# Altium schematic sheet Sheet1.SchDoc
size A4
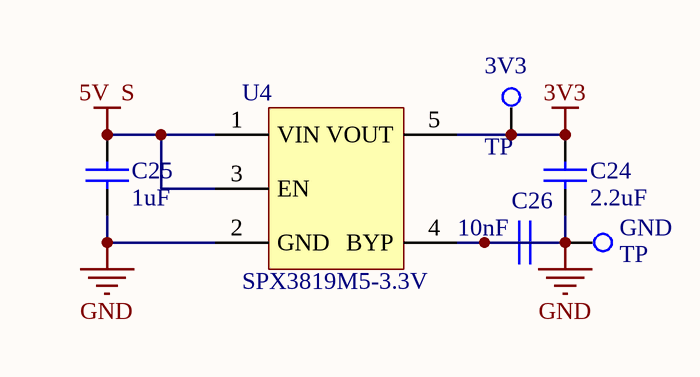
[diagram p0: Sheet1.SchDoc]

## Parts
(Parts that share a designator on the sheet are numbered #1, #2 ... from top to bottom, then left to right.)
C24  2.2uF  [0603C]
C25  1uF  [0603C]
C26  10nF  [0603C]
TP#1  3V3
TP#2  GND
U4  SPX3819M5-3.3V  [SOT-23 L]

## Nets
3V3: C24.2 TP#1.1 U4.5(VOUT)
5V  S: C25.2 U4.1(VIN) U4.3(EN)
GND: C24.1 C25.1 C26.1 C26.2 TP#2.1 U4.2(GND) U4.4(BYP)

## Notes on the sheet
- (near TP#1) TP

## Library data of the parts
C24-C26 = Cap: Capacitor; Value: 100pF; Published: 8-Jun-2000; LatestRevisionDate: 17-Jul-2002; LatestRevisionNote: Re-released for DXP Platform.; PackageReference: RAD-0.3; Publisher: Altium Limited; PackageDescription: Radial Cap, Thru-Hole; 2 Leads; 0.3 in Pin Spacing
TP#1 TP#2 = TP
U4 = LDO_SOT23-5